# Altium schematic sheet DecoderCircuit_M2.SchDoc
size A3; SheetNumber: 3; SheetTotal: 3; SPICEModelCacheVTPBUWVT: <root> / <DocumentId>VTPBUWVT</DocumentId> / <CacheFrame Number="0"> / <Model Name="sn74f08" Kind="MDL"> / <Text>*Texas Instruments / *SN74F08: FAST Quad 2-input AND / .MODEL SN74F08 xsimcode(file="{MODEL_PATH}FAST.SCB" func=f08 {mntymx})</Text> / </Model> / <Model Name="sn74f74" Kind="MDL"> / <Text>*Texas Instruments / *SN74F74: Dual Positive-Edge-Triggered D-Type Flip-Flop with Clear and Preset / .MODEL SN74F74 xsimcode(file="{MODEL_PATH}FAST.SCB" func=f74 {mntymx})</Text> / </Model> / <Model Name="sn74ls04" Kind="MDL"> / <Text>*Texas Instruments / *SN74LS04: LS Hex Inverter / .MODEL SN74LS04 xsimcode(file="{MODEL_PATH}LS.SCB" func=ls04 {mntymx})</Text> / </Model> / <Model Name="sn74f32" Kind="MDL"> / <Text>*Texas Instruments / *SN74F32: FAST Quad 2-in OR / .MODEL SN74F32 xsimcode(file="{MODEL_PATH}FAST.SCB" func=f32 {mntymx})</Text> / </Model> / </CacheFrame> / </root>
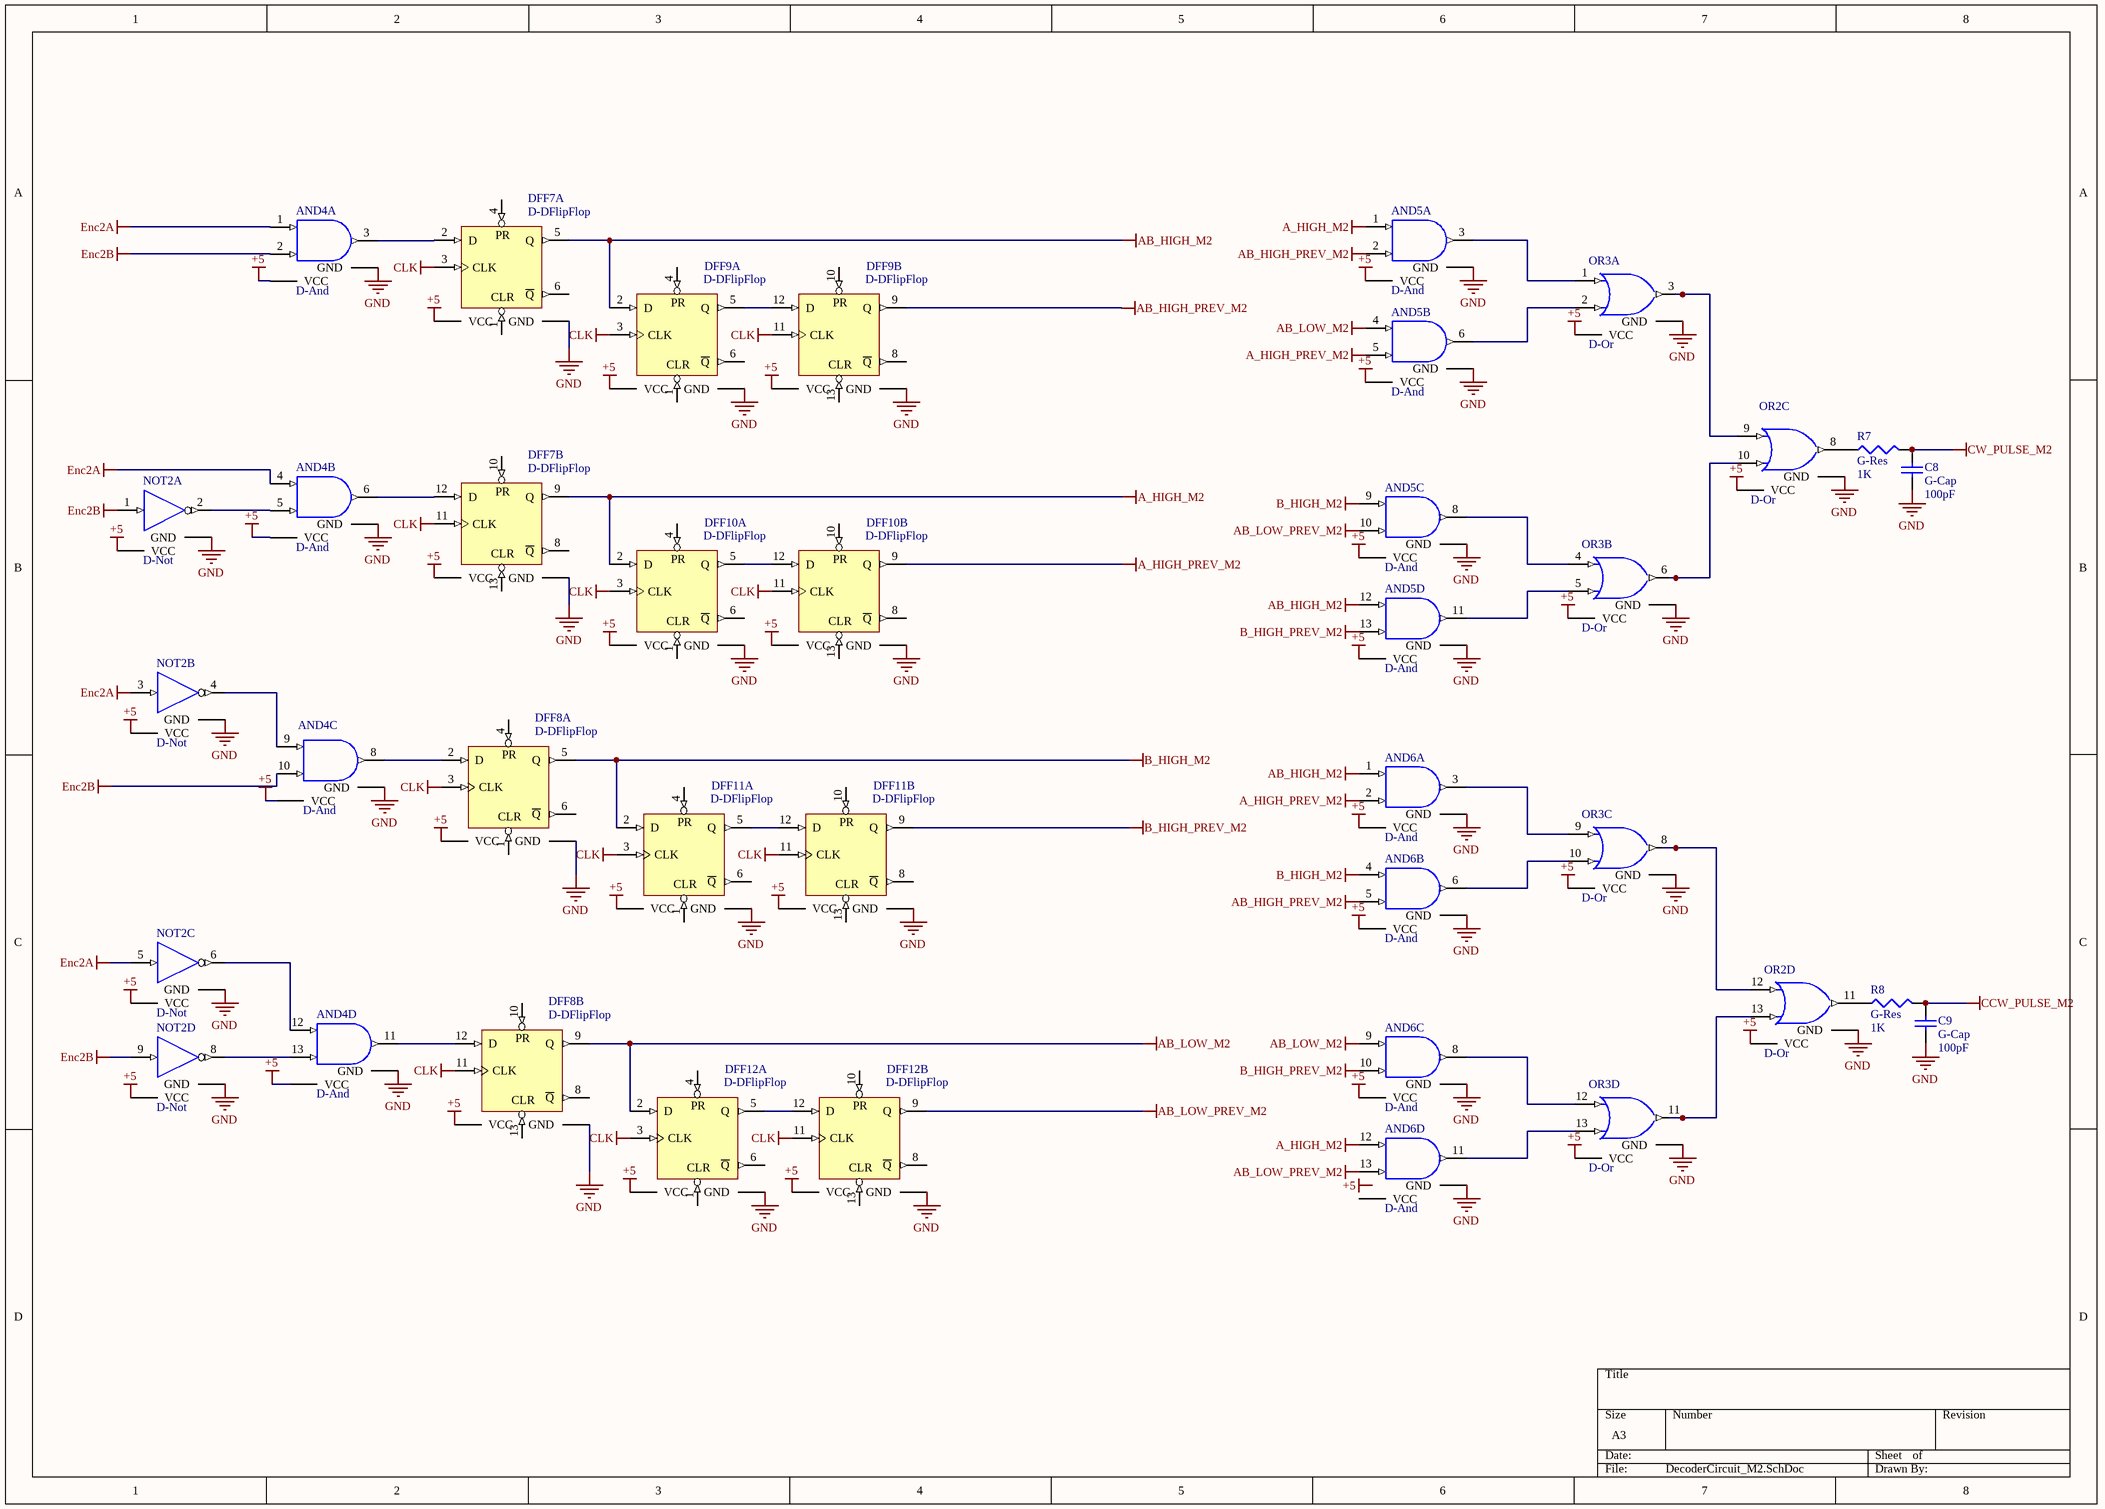
[diagram p0: DecoderCircuit_M2.SchDoc]

## Parts
AND4  D-And  [DIP14_LGE1.0]  (parts A,B,C,D of 4)
AND5  D-And  [DIP14_LGE1.0]  (parts A,B,C,D of 4)
AND6  D-And  [DIP14_LGE1.0]  (parts A,B,C,D of 4)
C8  G-Cap  value 100pF  [Cap2.54mm_LGE1.0]
C9  G-Cap  value 100pF  [Cap2.54mm_LGE1.0]
DFF7  D-DFlipFlop  [DIP14_LGE1.0]  (parts A,B of 2)
DFF8  D-DFlipFlop  [DIP14_LGE1.0]  (parts A,B of 2)
DFF9  D-DFlipFlop  [DIP14_LGE1.0]  (parts A,B of 2)
DFF10  D-DFlipFlop  [DIP14_LGE1.0]  (parts A,B of 2)
DFF11  D-DFlipFlop  [DIP14_LGE1.0]  (parts A,B of 2)
DFF12  D-DFlipFlop  [DIP14_LGE1.0]  (parts A,B of 2)
NOT2  D-Not  [DIP14_LGE1.0]  (parts A,B,C,D of 6)
OR2  D-Or  [DIP14_LGE1.0]  (parts C,D of 4)
OR3  D-Or  [DIP14_LGE1.0]  (parts A,B,C,D of 4)
R7  G-Res  value 1K  [Res10mm_LGE1.0]
R8  G-Res  value 1K  [Res10mm_LGE1.0]

## Nets
+5: AND4.14(VCC) AND5.14(VCC) AND6.14(VCC) DFF7.14(VCC) DFF8.14(VCC) DFF9.14(VCC) DFF10.14(VCC) DFF11.14(VCC) DFF12.14(VCC) NOT2.14(VCC) OR2.14(VCC) OR3.14(VCC)
A_HIGH_M2: AND5.1(A) AND6.12(A) DFF7.9(Q) DFF10.2(D)
A_HIGH_PREV_M2: AND5.5(B) AND6.2(B) DFF10.9(Q)
AB_HIGH_M2: AND5.12(A) AND6.1(A) DFF7.5(Q) DFF9.2(D)
AB_HIGH_PREV_M2: AND5.2(B) AND6.5(B) DFF9.9(Q)
AB_LOW_M2: AND5.4(A) AND6.9(A) DFF8.9(Q) DFF12.2(D)
AB_LOW_PREV_M2: AND5.10(B) AND6.13(B) DFF12.9(Q)
B_HIGH_M2: AND5.9(A) AND6.4(A) DFF8.5(Q) DFF11.2(D)
B_HIGH_PREV_M2: AND5.13(B) AND6.10(B) DFF11.9(Q)
CCW_PULSE_M2: C9.1 R8.2
CLK: DFF7.3(CLK) DFF7.11(CLK) DFF8.3(CLK) DFF8.11(CLK) DFF9.3(CLK) DFF9.11(CLK) DFF10.3(CLK) DFF10.11(CLK) DFF11.3(CLK) DFF11.11(CLK) DFF12.3(CLK) DFF12.11(CLK)
CW_PULSE_M2: C8.1 R7.2
Enc2A: AND4.1(A) AND4.4(A) NOT2.3(A) NOT2.5(A)
Enc2B: AND4.2(B) AND4.10(B) NOT2.1(A) NOT2.9(A)
GND: AND4.7(GND) AND5.7(GND) AND6.7(GND) C8.2 C9.2 DFF7.7(GND) DFF8.7(GND) DFF9.7(GND) DFF10.7(GND) DFF11.7(GND) DFF12.7(GND) NOT2.7(GND) OR2.7(GND) OR3.7(GND)
NetAND4_3: AND4.3(Y) DFF7.2(D)
NetAND4_5: AND4.5(B) NOT2.2(Y)
NetAND4_6: AND4.6(Y) DFF7.12(D)
NetAND4_8: AND4.8(Y) DFF8.2(D)
NetAND4_9: AND4.9(A) NOT2.4(Y)
NetAND4_11: AND4.11(Y) DFF8.12(D)
NetAND4_12: AND4.12(A) NOT2.6(Y)
NetAND4_13: AND4.13(B) NOT2.8(Y)
NetAND5_3: AND5.3(Y) OR3.1(A)
NetAND5_6: AND5.6(Y) OR3.2(B)
NetAND5_8: AND5.8(Y) OR3.4(A)
NetAND5_11: AND5.11(Y) OR3.5(B)
NetAND6_3: AND6.3(Y) OR3.9(A)
NetAND6_6: AND6.6(Y) OR3.10(B)
NetAND6_8: AND6.8(Y) OR3.12(A)
NetAND6_11: AND6.11(Y) OR3.13(B)
NetDFF9_5: DFF9.5(Q) DFF9.12(D)
NetDFF10_5: DFF10.5(Q) DFF10.12(D)
NetDFF11_5: DFF11.5(Q) DFF11.12(D)
NetDFF12_5: DFF12.5(Q) DFF12.12(D)
NetOR2_8: OR2.8(Y) R7.1
NetOR2_9: OR2.9(A) OR3.3(Y)
NetOR2_10: OR2.10(B) OR3.6(Y)
NetOR2_11: OR2.11(Y) R8.1
NetOR2_12: OR2.12(A) OR3.8(Y)
NetOR2_13: OR2.13(B) OR3.11(Y)

Not connected (* = marked no-connect by the designer): DFF7 1(CLR) 4(PR) 6(~{Q}) 8(~{Q}) 10(PR) 13(CLR); DFF8 1(CLR) 4(PR) 6(~{Q}) 8(~{Q}) 10(PR) 13(CLR); DFF9 1(CLR) 4(PR) 6(~{Q}) 8(~{Q}) 10(PR) 13(CLR); DFF10 1(CLR) 4(PR) 6(~{Q}) 8(~{Q}) 10(PR) 13(CLR); DFF11 1(CLR) 4(PR) 6(~{Q}) 8(~{Q}) 10(PR) 13(CLR); DFF12 1(CLR) 4(PR) 6(~{Q}) 8(~{Q}) 10(PR) 13(CLR)

## Notes on the sheet
- Labels drawn without touching a wire or pin: +5

## Library data of the parts
AND4-AND6 = D-And: Quad 2-input AND gate; Published: 8-Jun-2000; LatestRevisionDate: 04-Mar-2005; LatestRevisionNote: Stylized 3D Model Added.; DatasheetVersion: Oct-1993; PackageVersion: Oct-1995; PackageReference: N014; Publisher: Altium Limited; PackageDescription: DIP; 14 Leads; Row Spacing 7.62 mm; Pitch 2.54 mm; ComponentLink1Description: Manufacturer Link; ComponentLink1URL: http://www.ti.com/; ComponentLink2Description: Datasheet; ComponentLink2URL: http://www-s.ti.com/sc/ds/SN74F08.pdf; ComponentLink3URL: http://www.ti.com/lit/ds/symlink/cd74hct08.pdf; ComponentLink3Description: Datasheet (ELEC391)
C8 C9 = G-Cap: Capacitor (specify value); Published: 8-Jun-2000; LatestRevisionDate: 17-Jul-2002; LatestRevisionNote: Re-released for DXP Platform.; PackageReference: RAD-0.3; Publisher: Altium Limited
DFF7-DFF12 = D-DFlipFlop: Dual D flip-flop; Published: 8-Jun-2000; LatestRevisionDate: 04-Mar-2005; LatestRevisionNote: Stylized 3D Model Added.; DatasheetVersion: Oct-1993; PackageVersion: Jun-1999; PackageReference: J014; Publisher: Altium Limited; PackageDescription: DIP; 14 Leads; Row Spacing 7.62 mm; Pitch 2.54 mm; ComponentLink1Description: Manufacturer Link; ComponentLink1URL: http://www.ti.com/; ComponentLink2Description: Datasheet; ComponentLink2URL: http://www-s.ti.com/sc/ds/sn74f74.pdf; ComponentLink3URL: http://www.ti.com/lit/ds/symlink/sn74hct74.pdf; ComponentLink3Description: Datasheet (ELEC391)
NOT2 = D-Not: Hex NOT gate (inverter); Published: 8-Jun-2000; LatestRevisionDate: 04-Mar-2005; LatestRevisionNote: Stylized 3D Model Added.; DatasheetVersion: Mar-1988; PackageVersion: Oct-1995; PackageReference: N014; Publisher: Altium Limited; PackageDescription: DIP; 14 Leads; Row Spacing 7.62 mm; Pitch 2.54 mm; ComponentLink1Description: Manufacturer Link; ComponentLink1URL: http://www.ti.com/; ComponentLink2Description: Datasheet; ComponentLink2URL: http://www-s.ti.com/sc/ds/sn74ls04.pdf; ComponentLink3URL: http://media.digikey.com/pdf/Data%20Sheets/ST%20Microelectronics%20PDFS/M74HCT04.pdf; ComponentLink3Description: Datasheet (ELEC391)
OR2 OR3 = D-Or: Quad 2-input OR gate; Published: 8-Jun-2000; LatestRevisionDate: 04-Mar-2005; LatestRevisionNote: Stylized 3D Model Added.; DatasheetVersion: May-1999; PackageVersion: Oct-1995; PackageReference: N014; Publisher: Altium Limited; PackageDescription: DIP; 14 Leads; Row Spacing 7.62 mm; Pitch 2.54 mm; ComponentLink1Description: Manufacturer Link; ComponentLink1URL: http://www.ti.com/; ComponentLink2Description: Datasheet; ComponentLink2URL: http://www-s.ti.com/sc/ds/SN54F32.pdf; ComponentLink3URL: http://media.digikey.com/pdf/Data%20Sheets/ST%20Microelectronics%20PDFS/M74HCT32.pdf; ComponentLink3Description: Datasheet (ELEC391)
R7 R8 = G-Res: Resistor (specify value); Published: 8-Jun-2000; LatestRevisionDate: 29-May-2009; LatestRevisionNote: IPC-7351 Footprint Added.; PackageReference: J1-0603; Publisher: Altium Limited; PackageDescription: Chip Resistor